# Altium schematic sheet Microzed_Interfaces.SchDoc
size C; SheetNumber: 8; SheetTotal: 14
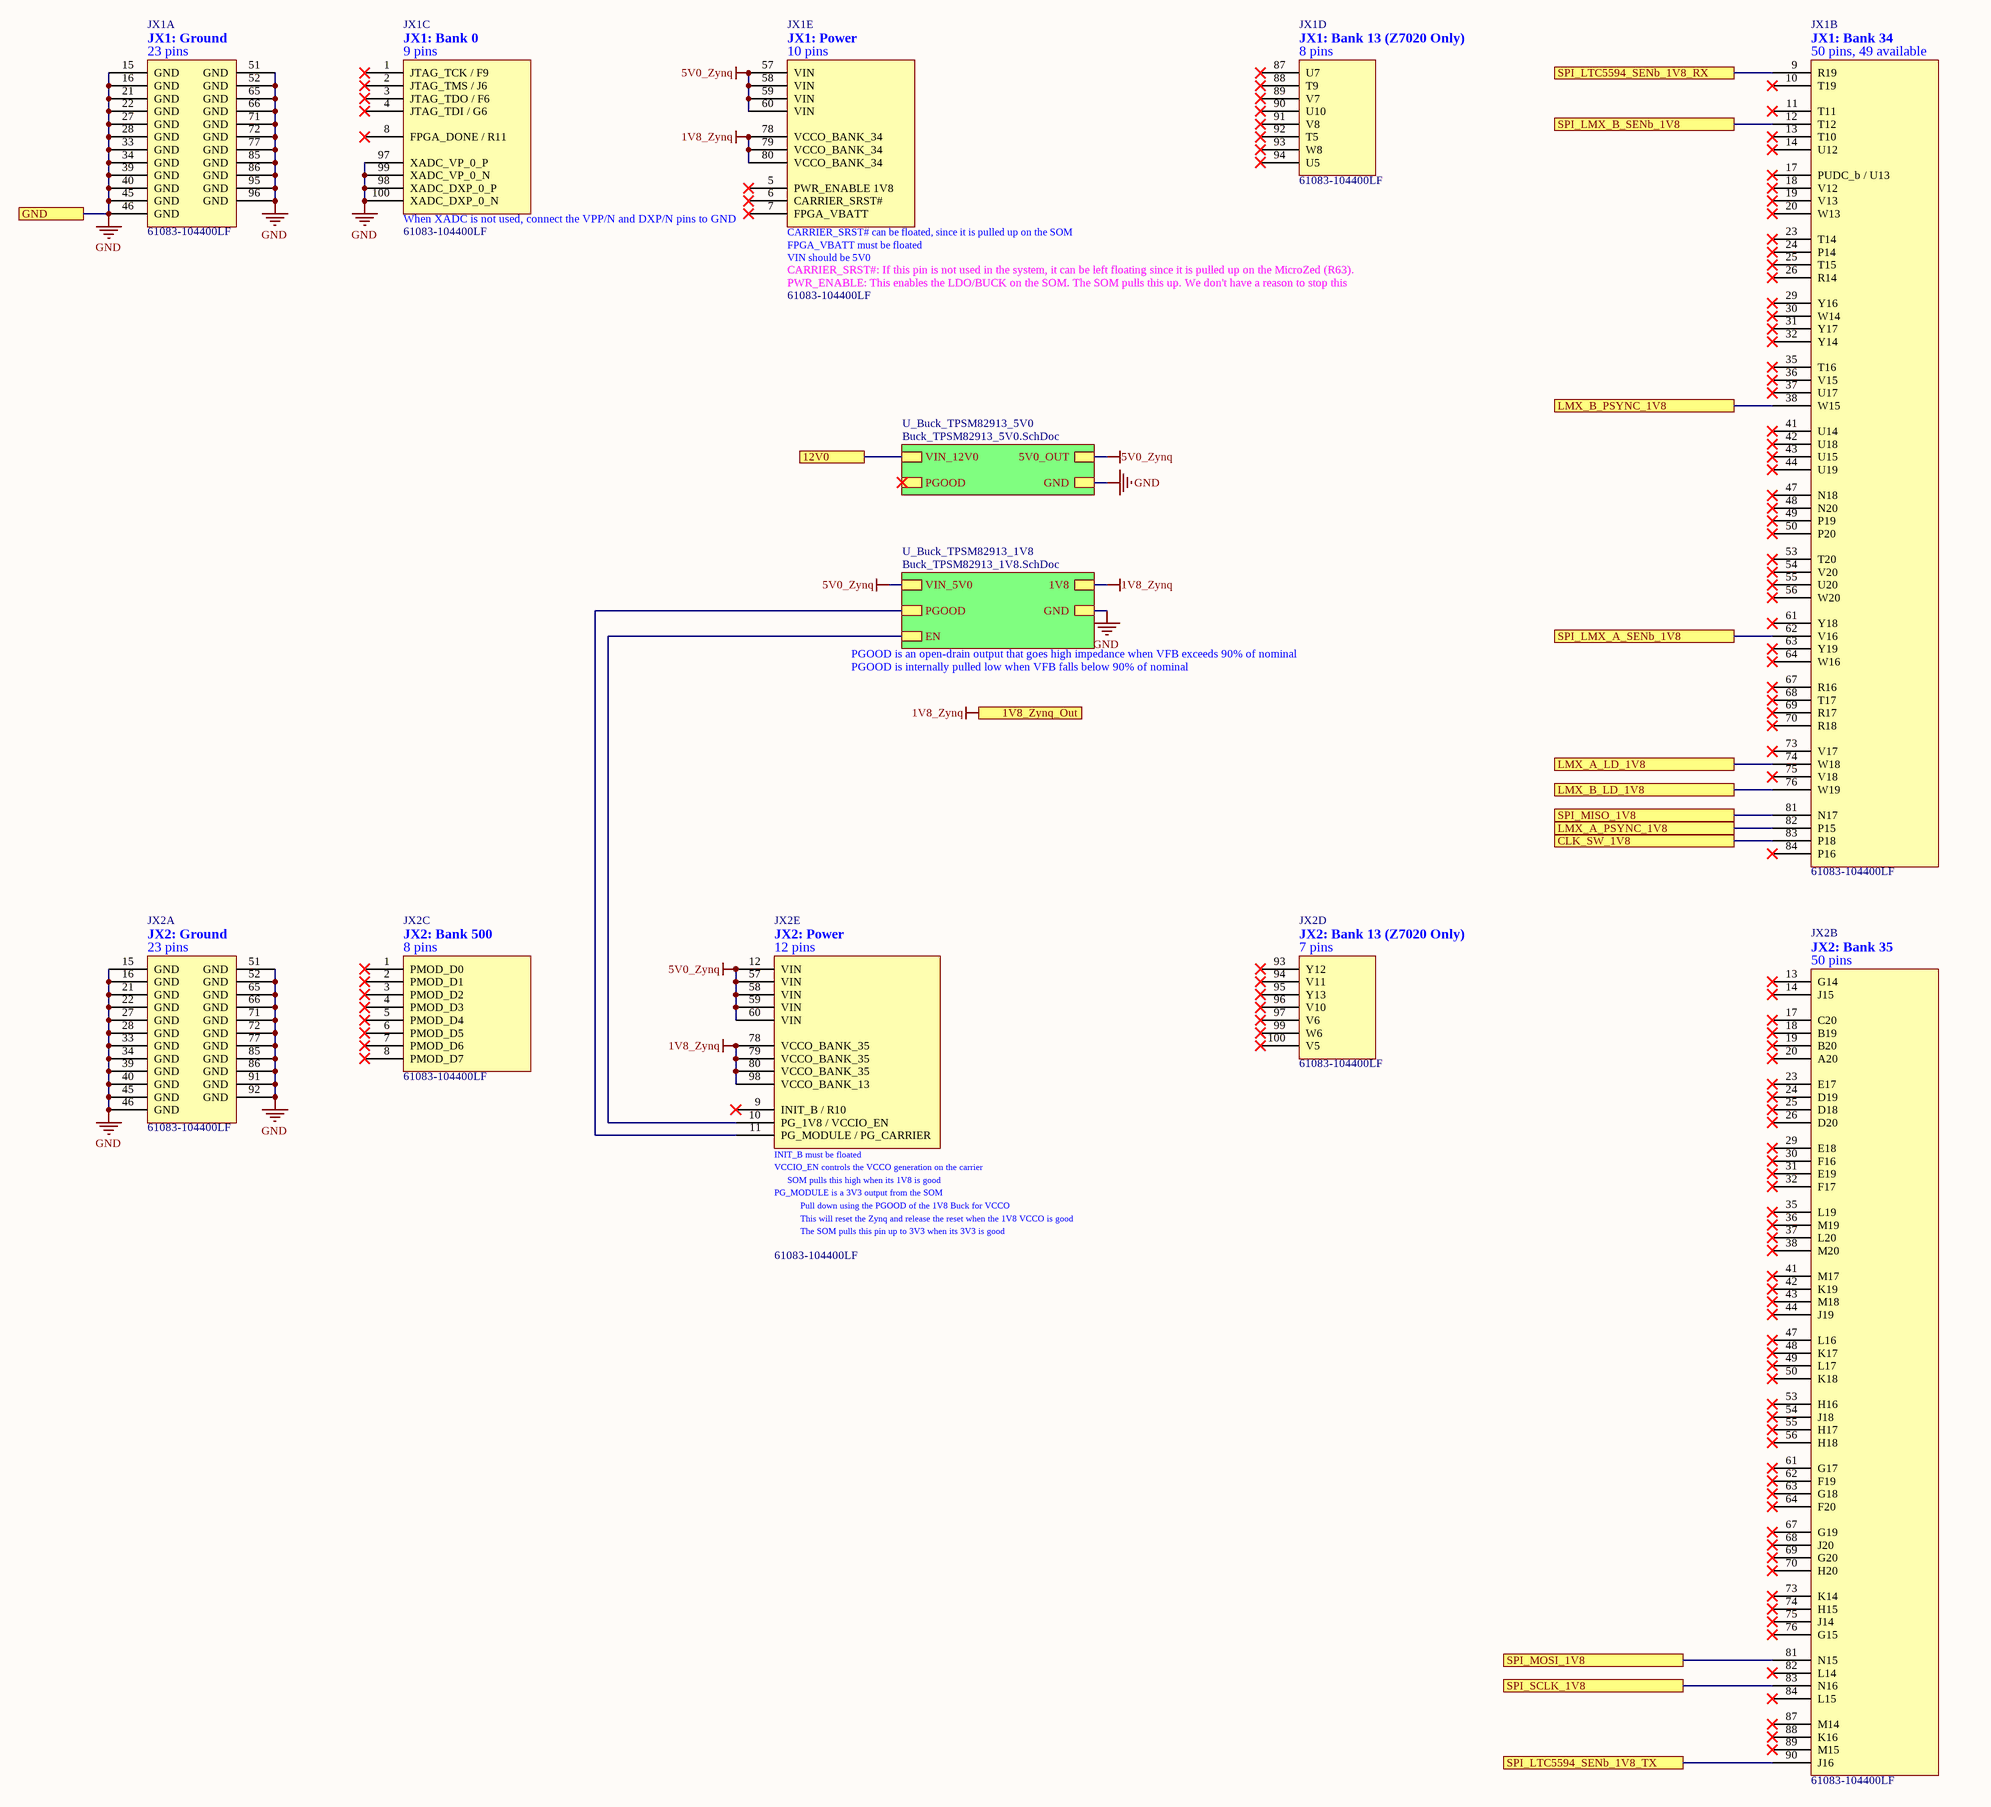
[diagram p0: Microzed_Interfaces.SchDoc]

## Parts
JX1  61083-104400LF  [Bergstak FCI_61083-101400LF]  (parts A,B,C,D,E of 5)
JX2  61083-104400LF  [Bergstak FCI_61083-101400LF]  (parts A,B,C,D,E of 5)

## Sub-sheets
U_Buck_TPSM82913_1V8 = Buck_TPSM82913_1V8.SchDoc: GND, VIN_5V0, PGOOD, 1V8, EN
U_Buck_TPSM82913_5V0 = Buck_TPSM82913_5V0.SchDoc: GND, VIN_12V0, PGOOD, 5V0_OUT

## Ports
1V8_Zynq_Out (see Main[4A]), 12V0 (see Main[4A]), CLK_SW_1V8 (see Main[5A]), GND (see Main[4A], 3V7_to_3V3_LDO[1B], 5V5_to_5V0_LDO[1C], Buck_TPSM82913_1V8[3C], Buck_TPSM82913_3V7[3C], Buck_TPSM82913_5V0[3C], Buck_TPSM82913_5V5[2C], Clocking_and_LO[2A], IQ_Demod[1C], IQ_Mod[1B], LMX2820[4D], Power_Supply[6B], Voltage_Conv_Bidirectional[1B]), LMX_A_LD_1V8 (see Main[4A]), LMX_A_PSYNC_1V8 (see Main[5A]), LMX_B_LD_1V8 (see Main[4A]), LMX_B_PSYNC_1V8 (see Main[5A]), SPI_LMX_A_SENb_1V8 (see Main[5A], Clocking_and_LO[4B]), SPI_LMX_B_SENb_1V8 (see Main[5A], Clocking_and_LO[4C]), SPI_LTC5594_SENb_1V8_RX (see Main[5A]), SPI_LTC5594_SENb_1V8_TX (see Main[5A]), SPI_MISO_1V8 (see Main[5A]), SPI_MOSI_1V8 (see Main[5A], Clocking_and_LO[4B]), SPI_SCLK_1V8 (see Main[5A], Clocking_and_LO[4B])

## Nets
1V8_Zynq: JX1.78(VCCO_BANK_34) JX1.79(VCCO_BANK_34) JX1.80(VCCO_BANK_34) JX2.78(VCCO_BANK_35) JX2.79(VCCO_BANK_35) JX2.80(VCCO_BANK_35) JX2.98(VCCO_BANK_13) ; port 1V8_Zynq_Out, sheet U_Buck_TPSM82913_1V8/1V8
5V0_Zynq: JX1.57(VIN) JX1.58(VIN) JX1.59(VIN) JX1.60(VIN) JX2.12(VIN) JX2.57(VIN) JX2.58(VIN) JX2.59(VIN) JX2.60(VIN) ; sheet U_Buck_TPSM82913_5V0/5V0_OUT, sheet U_Buck_TPSM82913_1V8/VIN_5V0
GND: JX1.15(GND) JX1.16(GND) JX1.21(GND) JX1.22(GND) JX1.27(GND) JX1.28(GND) JX1.33(GND) JX1.34(GND) JX1.39(GND) JX1.40(GND) JX1.45(GND) JX1.46(GND) JX1.51(GND) JX1.52(GND) JX1.65(GND) JX1.66(GND) JX1.71(GND) JX1.72(GND) JX1.77(GND) JX1.85(GND) JX1.86(GND) JX1.95(GND) JX1.96(GND) JX1.97(XADC_VP_0_P) JX1.98(XADC_DXP_0_P) JX1.99(XADC_VP_0_N) JX1.100(XADC_DXP_0_N) JX2.15(GND) JX2.16(GND) JX2.21(GND) JX2.22(GND) JX2.27(GND) JX2.28(GND) JX2.33(GND) JX2.34(GND) JX2.39(GND) JX2.40(GND) JX2.45(GND) JX2.46(GND) JX2.51(GND) JX2.52(GND) JX2.65(GND) JX2.66(GND) JX2.71(GND) JX2.72(GND) JX2.77(GND) JX2.85(GND) JX2.86(GND) JX2.91(GND) JX2.92(GND) ; port GND, sheet U_Buck_TPSM82913_5V0/GND, sheet U_Buck_TPSM82913_1V8/GND
12V0: port 12V0, sheet U_Buck_TPSM82913_5V0/VIN_12V0
CLK_SW_1V8: JX1.83(P18) ; port CLK_SW_1V8
LMX_A_LD_1V8: JX1.74(W18) ; port LMX_A_LD_1V8
LMX_A_PSYNC_1V8: JX1.82(P15) ; port LMX_A_PSYNC_1V8
LMX_B_LD_1V8: JX1.76(W19) ; port LMX_B_LD_1V8
LMX_B_PSYNC_1V8: JX1.38(W15) ; port LMX_B_PSYNC_1V8
SPI_LMX_A_SENb_1V8: JX1.62(V16) ; port SPI_LMX_A_SENb_1V8
SPI_LMX_B_SENb_1V8: JX1.12(T12) ; port SPI_LMX_B_SENb_1V8
SPI_LTC5594_SENb_1V8_RX: JX1.9(R19) ; port SPI_LTC5594_SENb_1V8_RX
SPI_LTC5594_SENb_1V8_TX: JX2.90(J16) ; port SPI_LTC5594_SENb_1V8_TX
SPI_MISO_1V8: JX1.81(N17) ; port SPI_MISO_1V8
SPI_MOSI_1V8: JX2.81(N15) ; port SPI_MOSI_1V8
SPI_SCLK_1V8: JX2.83(N16) ; port SPI_SCLK_1V8
NetJX2_10: JX2.10(PG_1V8_/_VCCIO_EN) ; sheet U_Buck_TPSM82913_1V8/EN
NetJX2_11: JX2.11(PG_MODULE_/_PG_CARRIER) ; sheet U_Buck_TPSM82913_1V8/PGOOD

Not connected (* = marked no-connect by the designer): JX1 1(JTAG_TCK_/_F9)* 2(JTAG_TMS_/_J6)* 3(JTAG_TDO_/_F6)* 4(JTAG_TDI_/_G6)* 5(PWR_ENABLE_1V8)* 6(CARRIER_SRST#)* 7(FPGA_VBATT)* 8(FPGA_DONE_/_R11)* 10(T19)* 11(T11)* 13(T10)* 14(U12)* 17(PUDC_b_/_U13)* 18(V12)* 19(V13)* 20(W13)* 23(T14)* 24(P14)* 25(T15)* 26(R14)* 29(Y16)* 30(W14)* 31(Y17)* 32(Y14)* 35(T16)* 36(V15)* 37(U17)* 41(U14)* 42(U18)* 43(U15)* 44(U19)* 47(N18)* 48(N20)* 49(P19)* 50(P20)* 53(T20)* 54(V20)* 55(U20)* 56(W20)* 61(Y18)* 63(Y19)* 64(W16)* 67(R16)* 68(T17)* 69(R17)* 70(R18)* 73(V17)* 75(V18)* 84(P16)* 87(U7)* 88(T9)* 89(V7)* 90(U10)* 91(V8)* 92(T5)* 93(W8)* 94(U5)*; JX2 1(PMOD_D0)* 2(PMOD_D1)* 3(PMOD_D2)* 4(PMOD_D3)* 5(PMOD_D4)* 6(PMOD_D5)* 7(PMOD_D6)* 8(PMOD_D7)* 9(INIT_B_/_R10)* 13(G14)* 14(J15)* 17(C20)* 18(B19)* 19(B20)* 20(A20)* 23(E17)* 24(D19)* 25(D18)* 26(D20)* 29(E18)* 30(F16)* 31(E19)* 32(F17)* 35(L19)* 36(M19)* 37(L20)* 38(M20)* 41(M17)* 42(K19)* 43(M18)* 44(J19)* 47(L16)* 48(K17)* 49(L17)* 50(K18)* 53(H16)* 54(J18)* 55(H17)* 56(H18)* 61(G17)* 62(F19)* 63(G18)* 64(F20)* 67(G19)* 68(J20)* 69(G20)* 70(H20)* 73(K14)* 74(H15)* 75(J14)* 76(G15)* 82(L14)* 84(L15)* 87(M14)* 88(K16)* 89(M15)* 93(Y12)* 94(V11)* 95(Y13)* 96(V10)* 97(V6)* 99(W6)* 100(V5)*

## Notes on the sheet
- CARRIER_SRST#: If this pin is not used in the system, it can be left floating since it is pulled up on the MicroZed (R63).
- PWR_ENABLE: This enables the LDO/BUCK on the SOM. The SOM pulls this up. We don't have a reason to stop this
- PGOOD is an open-drain output that goes high impedance when VFB exceeds 90% of nominal
- PGOOD is internally pulled low when VFB falls below 90% of nominal
- The SOM pulls this pin up to 3V3 when its 3V3 is good
- (in symbol MicroZed JX1, part A) JX1: Ground; 23 pins
- (in symbol MicroZed JX1, part B) JX1: Bank 34; 50 pins, 49 available
- (in symbol MicroZed JX1, part C) JX1: Bank 0; 9 pins; When XADC is not used, connect the VPP/N and DXP/N pins to GND
- (in symbol MicroZed JX1, part D) JX1: Bank 13 (Z7020 Only); 8 pins
- (in symbol MicroZed JX1, part E) JX1: Power; 10 pins; CARRIER_SRST# can be floated, since it is pulled up on the SOM; FPGA_VBATT must be floated; VIN should be 5V0
- (in symbol MicroZed JX2, part A) JX2: Ground; 23 pins
- (in symbol MicroZed JX2, part B) JX2: Bank 35; 50 pins
- (in symbol MicroZed JX2, part C) JX2: Bank 500; 8 pins
- (in symbol MicroZed JX2, part D) JX2: Bank 13 (Z7020 Only); 7 pins
- (in symbol MicroZed JX2, part E) JX2: Power; 12 pins; INIT_B must be floated; VCCIO_EN controls the VCCO generation on the carrier; SOM pulls this high when its 1V8 is good; PG_MODULE is a 3V3 output from the SOM; Pull down using the PGOOD of the 1V8 Buck for VCCO; This will reset the Zynq and release the reset when the 1V8 VCCO is good

## Library data of the parts
JX1 = MicroZed JX1: Bergstak FCI 61083-104400LF
JX2 = MicroZed JX2: Bergstak FCI 61083-104400LF